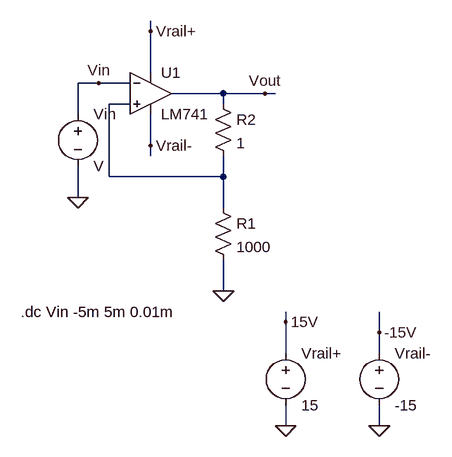
[diagram p0: schematic non-inverting-op-amp.asc]
non-inverting-op-amp.asc, the LTspice schematic file:
Version 4
SHEET 1 880 800
WIRE 432 176 432 160
WIRE 432 240 432 176
WIRE 352 256 320 256
WIRE 400 256 352 256
WIRE 544 272 464 272
WIRE 608 272 544 272
WIRE 624 272 608 272
WIRE 400 288 368 288
WIRE 544 288 544 272
WIRE 320 304 320 256
WIRE 432 352 432 304
WIRE 432 368 432 352
WIRE 368 400 368 288
WIRE 544 400 544 368
WIRE 544 400 368 400
WIRE 320 432 320 384
WIRE 544 448 544 400
WIRE 544 576 544 528
WIRE 640 624 640 608
WIRE 784 640 784 608
WIRE 640 672 640 624
WIRE 784 672 784 640
WIRE 640 784 640 752
WIRE 784 784 784 752
FLAG 432 176 Vrail+
FLAG 432 352 Vrail-
FLAG 352 256 Vin
FLAG 608 272 Vout
FLAG 544 576 0
FLAG 640 784 0
FLAG 784 784 0
FLAG 640 624 15V
FLAG 784 640 -15V
FLAG 320 432 0
SYMBOL LM741 432 208 R0
SYMATTR InstName U1
SYMBOL Res 528 272 R0
SYMATTR InstName R2
SYMATTR Value 1
SYMBOL Res 528 432 R0
SYMATTR InstName R1
SYMATTR Value 1000
SYMBOL Voltage 640 656 R0
SYMATTR InstName Vrail+
SYMATTR Value 15
SYMBOL Voltage 784 656 R0
SYMATTR InstName Vrail-
SYMATTR Value -15
SYMBOL Voltage 320 288 R0
SYMATTR InstName Vin
TEXT 232 608 Left 2 !.dc Vin -5m 5m 0.01m

The netlist it stands for:
* non-inverting-op-amp.asc
XU1 N001 Vin Vrail+ Vrail- Vout LM741  ; pins In+ In- V+ V- OUT
R2 Vout N001 1
R1 N001 0 1000
Vrail+ 15V 0 15
Vrail- -15V 0 -15
Vin Vin 0 V
.dc Vin -5m 5m 0.01m
.lib LM741.lib
.backanno
.end